# Altium schematic sheet SCH_V_and_curr.SchDoc
size A4; Author: Filip Kulka; SheetNumber: 1; SheetTotal: 1; Desc: Small PCB for LiPo current and Voltage measurement.; BOM: BOM_V_and_curr.BomDoc
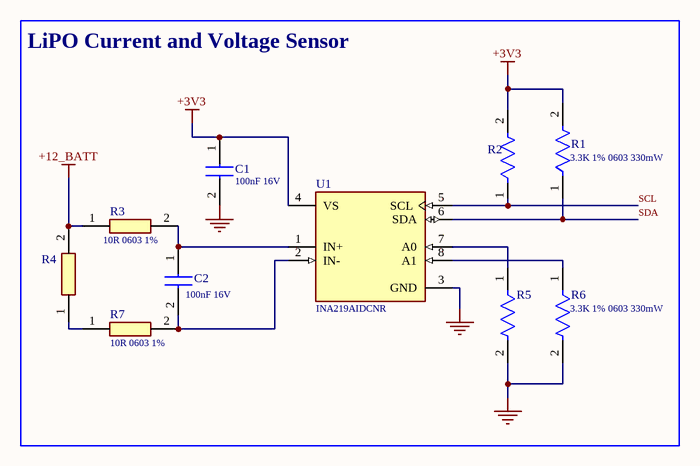
[diagram p0: SCH_V_and_curr.SchDoc]

## Parts
?  (no value)
C1  100nF 16V  [CAPC1608X90N]
C2  100nF 16V  [CAPC1608X90N]
R1  3.3K 1% 0603 330mW
R2  3.3K 1% 0603 330mW  (value not drawn)
R3  10R 0603 1%  [RESC1608X55N]
R4  WSR2R0500FEA  [WSR2R0500FEA]  (value not drawn)
R5  3.3K 1% 0603 330mW  (value not drawn)
R6  3.3K 1% 0603 330mW
R7  10R 0603 1%  [RESC1608X55N]
U1  INA219AIDCNR  [FP-DCN0008A-IPC_B]

## Blocks framed on the sheet
LiPO Current and Voltage Sensor: C1 C2 R1-R7 U1

## Nets
+3V3: C1.1 R1.2 R2.2 U1.4(VS)
+12_BATT: R3.1 R4.2
GND: C1.2 R5.2 R6.2 U1.3(GND)
SCL: R2.1 U1.5(SCL)
SDA: R1.1 U1.6(SDA)
NetC2_1: C2.1 R3.2 U1.1(IN+)
NetC2_2: C2.2 R7.2 U1.2(IN-)
NetR4_1: R4.1 R7.1
NetR5_1: R5.1 U1.7(A0)
NetR6_1: R6.1 U1.8(A1)

## Notes on the sheet
- Author:
- Title:
- Project:
- BOM file:
- Date:
- Last Update:
- Revision:
- Checked by:
- File:
- Desc:
- Sheet
- of

## Library data of the parts
? = TitleBlock: This is a custom title block with my logo and a bit more info than the default one
C1 C2 = 0603YC104K4T4A: 100nF 0603 16V; Manufacturer_Name: Kyocera AVX; Datasheet Link: https://componentsearchengine.com/Datasheets/1/06031A100FAT2A.pdf; Height: 0.9mm; Manufacturer_Part_Number: 0603YC104K4T4A; Mouser Part Number: 581-0603YC104K4T4A; Mouser Price/Stock: https://www.mouser.co.uk/ProductDetail/KYOCERA-AVX/0603YC104K4T4A?qs=Cej1j9ztgjEkPqVJkA4Bng%3D%3D; Arrow Part Number: 0603YC104K4T4A; Arrow Price/Stock: https://www.arrow.com/en/products/0603yc104k4t4a/avx
R1 R2 R5 R6 = CRCW06033K30FKECH
R3 R7 = KTR03EZPF10R0: Manufacturer_Name: ROHM Semiconductor; Datasheet Link: http://rohmfs.rohm.com/en/products/databook/datasheet/passive/resistor/chip_resistor/ktr.pdf; Height: 0.55mm; Manufacturer_Part_Number: KTR03EZPF10R0; Mouser Part Number: 755-KTR03EZPF10R0; Mouser Price/Stock: https://www.mouser.co.uk/ProductDetail/ROHM-Semiconductor/KTR03EZPF10R0?qs=Z4wLSx0Y7o6aTc4EM6rn5w%3D%3D
R4 = WSR2R0500FEA: R050 1% 4527 2W; Manufacturer_Name: Vishay; Datasheet Link: http://www.mouser.com/ds/2/427/wsr-239755.pdf; Height: 2.537mm; Manufacturer_Part_Number: WSR2R0500FEA; Mouser Part Number: 71-WSR2R0500FEA; Mouser Price/Stock: https://www.mouser.com/Search/Refine.aspx?Keyword=71-WSR2R0500FEA; Arrow Part Number: WSR2R0500FEA; Arrow Price/Stock: https://www.arrow.com/en/products/wsr2r0500fea/vishay
U1 = CMP-0704-00041-3: IC CURRENT MONITOR 1% SOT23-8; Common Mode Rejection Ratio: 100dB; Bandwidth: 3.4MHz; Operating Supply Current: 1mA; Nominal Supply Current: 700uA; Min Input Voltage: 0V; Output Current per Channel: 10mA; Number of Amplifiers: 1; Input Offset Voltage (Vos): 100uV; Max Input Voltage: 26V; Min Supply Voltage: 3V; Max Supply Current: 5mA; Max Supply Voltage: 5.5V; Output Type: Digital; Accuracy: 1%; Radiation Hardening: No; Min Operating Temperature: -40°C; Contact Plating: Gold; REACH SVHC: No SVHC; Packaging: Tape and Reel; Max Operating Temperature: 125°C; Lead Free: Lead Free; Weight: 0.001411oz; Supply Current: 700uA; Number of Pins: 8; Length: 3mm; Quiescent Current: 700uA; Features: I²C; Height: 1.3mm; Output Current: 10mA; Case/Package: SOT-23-8; RoHS Compliant: Yes; Width: 1.75mm; Package Quantity: 3000; Series: Zero-Drift